# Altium project Project_ESP32DataHub.PrjPcb
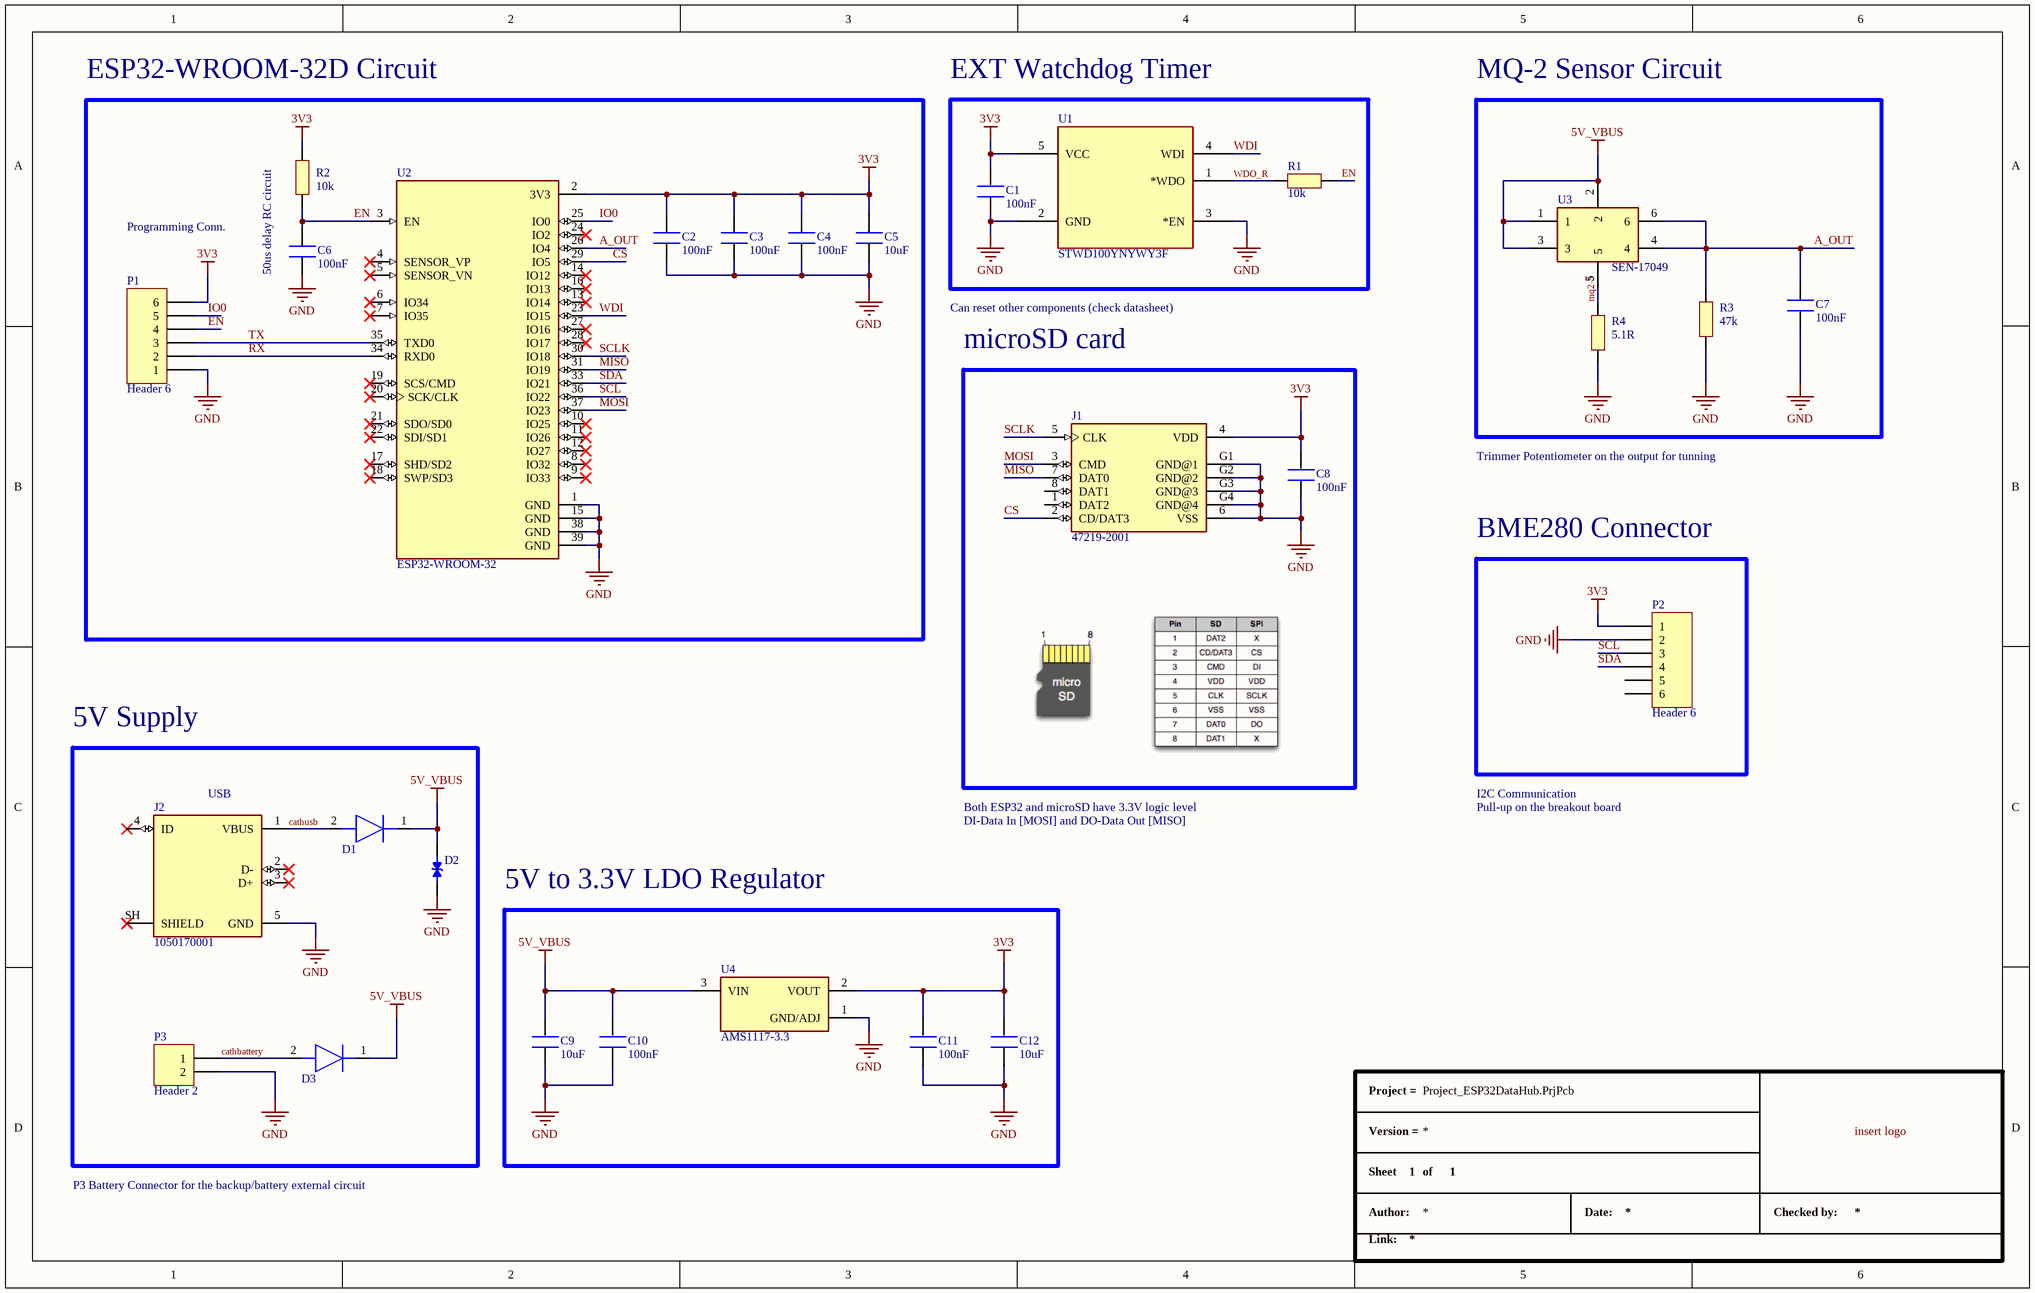
[diagram p0: main.SchDoc]
1 sheet, 28 parts. Net scope: global (net labels, ports and power ports of the same name join across sheets).
Board files: main.PcbDoc, version2.PcbDoc

## Sheet main.SchDoc
size B; SheetNumber: 1; SheetTotal: 1

### Parts
C1  100nF  [CAP_0603]
C2  100nF  [CAP_0603]
C3  100nF  [CAP_0603]
C4  100nF  [CAP_0603]
C5  10uF  [CAP_0603]
C6  100nF  [CAP_0603]
C7  100nF  [CAP_0603]
C8  100nF  [CAP_0603]
C9  10uF  [CAP_0603]
C10  100nF  [CAP_0603]
C11  100nF  [CAP_0603]
C12  10uF  [CAP_0603]
D1  CDBA240LL-HF  [DIOM5225X250N]  (value not drawn)
D2  SLESDL0603-12  [TVS0603]  (value not drawn)
D3  CDBA240LL-HF  [DIOM5225X250N]  (value not drawn)
J1  47219-2001  [47219-2001]
J2  1050170001  [MOLEX-1050170001]
P1  Header 6  [HDR1X6]
P2  Header 6  [HDR1X6]
P3  Header 2  [HDR1X2]
R1  10k  [RES_0603]
R2  10k  [RES_0603]
R3  47k  [RES_0603]
R4  5.1R  [RES_0603]
U1  STWD100YNYWY3F  [STWD100YNYWY3F]
U2  ESP32-WROOM-32  [ESP32-WROOM-32-Nx]
U3  SEN-17049  [SEN17049]
U4  AMS1117-3.3  [SOT229P700X180-4N]

### Blocks framed on the sheet
ESP32-WROOM-32D Circuit: C2-C6 P1 R2 U2
EXT Watchdog Timer: C1 R1 U1
MQ-2 Sensor Circuit: C7 R3 R4 U3
microSD card: C8 J1
BME280 Connector: P2
5V Supply: D1-D3 J2 P3
5V to 3.3V LDO Regulator: C9-C12 U4

### Nets
3V3: C1.1 C2.2 C3.2 C4.2 C5.2 C8.1 C11.2 C12.2 J1.4(VDD) P1.6 P2.1 R2.2 U1.5(VCC) U2.2(3V3) U4.2(VOUT)
5V_VBUS: C9.2 C10.2 D1.1(K) D2.2 D3.1(K) U3.1 U3.2 U3.3 U4.3(VIN)
GND: C1.2 C2.1 C3.1 C4.1 C5.1 C6.1 C7.1 C8.2 C9.1 C10.1 C11.1 C12.1 D2.1 J1.6(VSS) J1.G1(GND@1) J1.G2(GND@2) J1.G3(GND@3) J1.G4(GND@4) J2.5(GND) P1.1 P2.2 P3.2 R3.1 R4.1 U1.2(GND) U1.3(*EN) U2.1(GND) U2.15(GND) U2.38(GND) U2.39(GND) U4.1(GND/ADJ)
A_OUT: C7.2 R3.2 U2.26(IO4) U3.4 U3.6
cathbattery: D3.2(A) P3.1
cathusb: D1.2(A) J2.1(VBUS)
CS: J1.2(CD/DAT3) U2.29(IO5)
EN: C6.2 P1.4 R1.2 R2.1 U2.3(EN)
IO0: P1.5 U2.25(IO0)
MISO: J1.7(DAT0) U2.31(IO19)
MOSI: J1.3(CMD) U2.37(IO23)
mq2-5: R4.2 U3.5
RX: P1.2 U2.34(RXD0)
SCL: P2.3 U2.36(IO22)
SCLK: J1.5(CLK) U2.30(IO18)
SDA: P2.4 U2.33(IO21)
TX: P1.3 U2.35(TXD0)
WDI: U1.4(WDI) U2.23(IO15)
WDO_R: R1.1 U1.1(*WDO)

Not connected (* = marked no-connect by the designer): J1 1(DAT2) 8(DAT1); J2 2(D-)* 3(D+)* 4(ID)* SH(SHIELD)*; P2 5 6; U2 4(SENSOR_VP)* 5(SENSOR_VN)* 6(IO34)* 7(IO35)* 8(IO32)* 9(IO33)* 10(IO25)* 11(IO26)* 12(IO27)* 13(IO14)* 14(IO12)* 16(IO13)* 17(SHD/SD2)* 18(SWP/SD3)* 19(SCS/CMD)* 20(SCK/CLK)* 21(SDO/SD0)* 22(SDI/SD1)* 24(IO2)* 27(IO16)* 28(IO17)*

### Notes on the sheet
- Programming Conn.
- 50us delay RC circuit
- Can reset other components (check datasheet)
- Trimmer Potentiometer on the output for tunning
- (near J2) USB
- Both ESP32 and microSD have 3.3V logic level
- DI-Data In [MOSI] and DO-Data Out [MISO]
- I2C Communication
- Pull-up on the breakout board
- P3 Battery Connector for the backup/battery external circuit
- Labels drawn without touching a wire or pin: insert logo
- Project =
- Version =
- Sheet
- of
- Author:
- Link:
- Date:
- Checked by:

### Library data of the parts
C1-C12 = Cap_0603: Capacitor SMD 0603 Generic
D1 D3 = CDBA240LL-HF: Diode; Manufacturer_Name: Comchip Technology; Datasheet Link: https://datasheet.datasheetarchive.com/originals/distributors/Datasheets-DGA22/1401764.pdf; Height: 2.5mm; Manufacturer_Part_Number: CDBA240LL-HF; Mouser Part Number: 750-CDBA240LL-HF; Mouser Price/Stock: https://www.mouser.co.uk/ProductDetail/Comchip-Technology/CDBA240LL-HF?qs=2qJf6qQ4IOK8%252BRkX5aZc7g%3D%3D; Arrow Part Number: CDBA240LL-HF; Arrow Price/Stock: https://www.arrow.com/en/products/cdba240ll-hf/comchip-technology?region=nac
D2 = TVSDiode0603: Ultra low capacitance (1.5pF typ.) / Very low leakage current / Fast response time / Bi-directional / max.12V / C.V. = 100V max.
J1 = microSD Card Conn: 1.1mm Pitch microSD Card Connector, Hinge Type, Lead Free | Molex Incorporated 47219-2001
J2 = Molex_1050170001: USB - micro B USB 2.0 Receptacle Connector 5 Position Surface Mount, Right Angle; Through Hole
P1 P2 = Header 6: Header, 6-Pin; LatestRevisionDate: 17-Jul-2002; LatestRevisionNote: Re-released for DXP Platform.; Publisher: Altium Limited
P3 = Header 2: Header, 2-Pin; LatestRevisionDate: 17-Jul-2002; LatestRevisionNote: Re-released for DXP Platform.; Publisher: Altium Limited
R1-R4 = Res_0603: Resistor SMD 0603 Generic
U1 = STWD100YNYWY3F: 1.12s Active Low 1 SOT-23-5 Monitors & Reset Circuits ROHS
U2 = ESP32-WROOM-32-Nx: Bluetooth, WiFi 802.11b/g/n, Bluetooth v4.2 +EDR, Class 1, 2 and 3 Transceiver Module 2.4GHz ~ 2.5GHz PCB Trace Surface Mount
U3 = SEN-17049: Undefined or Miscellaneous; Manufacturer_Name: SparkFun; Datasheet Link: https://eu.mouser.com/datasheet/2/813/MQ_2-1915159.pdf; Height: 20mm; Manufacturer_Part_Number: SEN-17049; Mouser Part Number: 474-SEN-17049; Mouser Price/Stock: https://www.mouser.co.uk/ProductDetail/SparkFun/SEN-17049?qs=DPoM0jnrROWDFAIFRzjoUQ%3D%3D; Arrow Part Number: SEN-17049; Arrow Price/Stock: https://www.arrow.com/en/products/sen-17049/sparkfun-electronics?region=nac
U4 = AMS1117-3.3: Sot223/Pkg 1-Amp 3.3-Volt Low Drop Out Voltage Regulatator